# Altium schematic sheet Power.SchDoc
size A
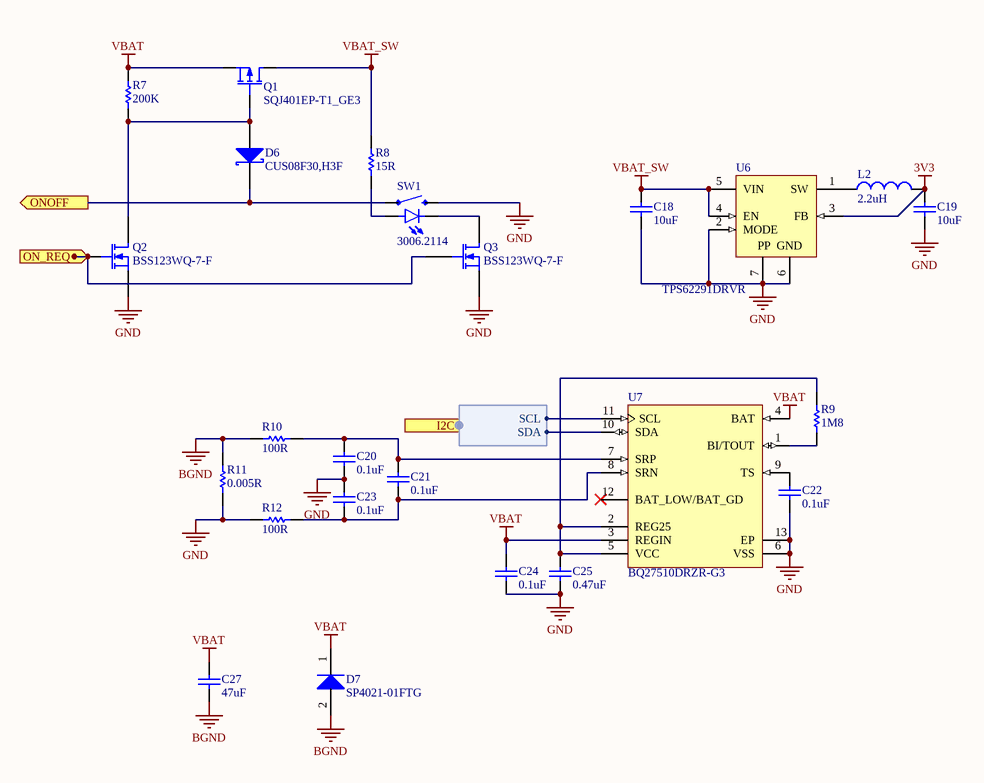
[diagram p0: Power.SchDoc]

## Parts
C18  value 10uF  [C0402[1005X55]]  (hidden comment: 10uF 6.3V 0402)
C19  value 10uF  [C0402[1005X55]]  (hidden comment: 10uF 6.3V 0402)
C20  value 0.1uF  [C0402[1005X55]]  (hidden comment: 0.1uF 6.3V 0402)
C21  value 0.1uF  [C0402[1005X55]]  (hidden comment: 0.1uF 6.3V 0402)
C22  value 0.1uF  [C0402[1005X55]]  (hidden comment: 0.1uF 6.3V 0402)
C23  value 0.1uF  [C0402[1005X55]]  (hidden comment: 0.1uF 6.3V 0402)
C24  value 0.1uF  [C0402[1005X55]]  (hidden comment: 0.1uF 6.3V 0402)
C25  value 0.47uF  [C0402[1005X55]]  (hidden comment: 0.47uF 25V 0402)
C27  value 47uF  [C1206[3216X160]]  (hidden comment: 47uF 6.3V 1206)
D6  CUS08F30,H3F  [SOD-323]
D7  SP4021-01FTG  [SOD-323]
L2  2.2uH  [IND0805]
Q1  SQJ401EP-T1_GE3  [PowerPak-8]
Q2  BSS123WQ-7-F  [SOT323-3]
Q3  BSS123WQ-7-F  [SOT323-3]
R7  value 200K  [R0402[1005]]  (hidden comment: 200K 1% 0402)
R8  value 15R  [R0402[1005]]  (hidden comment: 15R 1% 0402)
R9  value 1M8  [R0402[1005]]  (hidden comment: 1M8 1% 0402)
R10  value 100R  [R0402[1005]]  (hidden comment: 100R 1% 0402)
R11  value 0.005R  [R2512[6432]]  (hidden comment: 0.005R 1% 2512)
R12  value 100R  [R0402[1005]]  (hidden comment: 100R 1% 0402)
SW1  3006.2114  [PCBComponent_1]
U6  TPS62291DRVR  [WSON-6]
U7  BQ27510DRZR-G3  [VSON-12]

## Ports
I2C (harness I2C), ON_REQ (in), ONOFF (out)

## Harnesses
I2C: SCL, SDA

## Nets
3V3: C19.2 L2.2 U6.3(FB)
BGND: C27.1 D7.2(A) R10.1 R11.2
GND: C18.1 C19.1 C20.1 C22.1 C23.2 C24.1 C25.1 Q2.2(S) Q3.2(S) R11.1 R12.1 SW1.2 U6.2(MODE) U6.6(GND) U6.7(EP) U7.6(VSS) U7.13(EP)
VBAT: C24.2 C27.2 D7.1(K) Q1.1(S) R7.2 U7.3(REGIN) U7.4(BAT)
VBAT_SW: C18.2 Q1.3(D) R8.2 U6.4(EN) U6.5(VIN)
ON_REQ: Q2.1(G) Q3.1(G) ; port ON_REQ
ONOFF: D6.1(K) SW1.1 ; port ONOFF
NetC20_2: C20.2 C21.2 R10.2 U7.7(SRP)
NetC21_1: C21.1 C23.1 R12.2 U7.8(SRN)
NetC22_2: C22.2 U7.9(TS)
NetC25_2: C25.2 R9.2 U7.2(REG25) U7.5(VCC)
NetD6_2: D6.2(A) Q1.2(G) Q2.3(D) R7.1
NetL2_1: L2.1 U6.1(SW)
NetQ3_3: Q3.3(D) SW1.K
NetR8_1: R8.1 SW1.A
NetR9_1: R9.1 U7.1(BI/TOUT)
NetU7_10: U7.10(SDA) ; port I2C.SDA
NetU7_11: U7.11(SCL) ; port I2C.SCL

Not connected (* = marked no-connect by the designer): U7 12(BAT_LOW/BAT_GD)*

## Notes on the sheet
- (in symbol TPS62291DRVR) PP

## Library data of the parts
C18 C19 = CAP_10uF_6.3V_0402_20%: 10uF 6.3V 20% 0402 (1005 Metric); PartNumber: GRM155R60J106ME44D; Manufacturer: Murata; Tolerance: 20%; Mounting Technology: Surface Mount; PackageReference: 0402; PackageDescription: 0402 (1005 Metric); Voltage: 6.3V
C20-C24 = CAP_0.1uF_6.3V_0402_10%: 0.1uF 6.3V 10% 0402 (1005 Metric); PartNumber: GRM155R70J104KA01D; Manufacturer: Murata; Mounting Technology: Surface Mount; PackageReference: 0402; PackageDescription: 0402 (1005 Metric); Voltage: 6.3V; Tolerance: 10%
C25 = CAP_0.47uF_25V_0402_10%: 0.47uF 25V 10% 0402 (1005 Metric); PartNumber: GRM155R61E474KE01D; Manufacturer: Murata; Mounting Technology: Surface Mount; PackageReference: 0402; PackageDescription: 0402 (1005 Metric); Voltage: 25V; Tolerance: 10%
C27 = CAP_47uF_6.3V_1206_10%: 47uF 6.3V 10% 1206 (3216 Metric); PartNumber: GRM31CR60J476KE19L; Manufacturer: Murata; Mounting Technology: Surface Mount; PackageReference: 1206; PackageDescription: 1206 (3216 Metric); Voltage: 6.3V; Tolerance: 10%
D6 = CUS08F30,H3F: Manufacturer: Toshiba; PackageReference: SOD-323; PartNumber: CUS08F30,H3F; Mounting Technology: Surface Mount
D7 = SP4021-01FTG: Manufacturer: Littelfuse; PartNumber: SP4021-01FTG; PackageReference: SOD-323-2; Mounting Technology: Surface Mount
L2 = IND_2.2uH_1.7A_0805_20%: 2.2uH 20% 1.7A 0805; PartNumber: LQM21PN2R2MGHL; Manufacturer: Murata; PackageReference: 0805; PackageDescription: 0805 (2012 metric); Value: 2.2uH; Mounting Technology: Surface Mount; Current: 1.7A
Q1 = SQJ401EP-T1_GE3: P-Channel MOSFET; Manufacturer: Vishay; PartNumber: SQJ401EP-T1_GE3; Mounting Technology: Surface Mount; PackageReference: PowerPAK SO-8
Q2 Q3 = BSS123WQ-7-F: N-Channel MOSFET; Manufacturer: Diodes Incorporated; PartNumber: BSS123WQ-7-F; PackageReference: SOT-323-3; Mounting Technology: Surface Mount
R7 = RES_200K_0402_1%: 200K 0.063W 1% 0402 (1005 Metric); Manufacturer: KOA Speer; PartNumber: RK73H1ETTP2003F; Tolerance: 1%; Power: 0.063W; Mounting Technology: Surface Mount; PackageReference: 0402; PackageDescription: 0402 (1005 Metric); ComponentLink1Description: Datasheet; ComponentLink1URL: http://www.koaspeer.com/catimages/Products/RK73H/RK73H.pdf
R8 = RES_15R_0402_1%: 15R 0.063W 1% 0402 (1005 Metric); Manufacturer: KOA Speer; PartNumber: RK73H1ETTP15R0F; Tolerance: 1%; Power: 0.063W; Mounting Technology: Surface Mount; PackageReference: 0402; PackageDescription: 0402 (1005 Metric); ComponentLink1Description: Datasheet; ComponentLink1URL: http://www.koaspeer.com/catimages/Products/RK73H/RK73H.pdf
R9 = RES_1M8_0402_1%: 1M8 0.063W 1% 0402 (1005 Metric); Manufacturer: KOA Speer; PartNumber: RK73H1ETTP1804F; Tolerance: 1%; Power: 0.063W; Mounting Technology: Surface Mount; PackageReference: 0402; PackageDescription: 0402 (1005 Metric); ComponentLink1Description: Datasheet; ComponentLink1URL: http://www.koaspeer.com/catimages/Products/RK73H/RK73H.pdf
R10 R12 = RES_100R_0402_1%: 100R 0.063W 1% 0402 (1005 Metric); Manufacturer: KOA Speer; PartNumber: RK73H1ETTP1000F; Tolerance: 1%; Power: 0.063W; Mounting Technology: Surface Mount; PackageReference: 0402; PackageDescription: 0402 (1005 Metric); ComponentLink1Description: Datasheet; ComponentLink1URL: http://www.koaspeer.com/catimages/Products/RK73H/RK73H.pdf
R11 = RES_0.005R_2512_1%: 0.005R 2.5W 1% 2512 (6432 Metric); Manufacturer: Riedon; PartNumber: CSR2512B0R005F; Tolerance: 1%; Power: 2.5W; Mounting Technology: Surface Mount; PackageReference: 2512; PackageDescription: 2512 (6432 Metric); ComponentLink1Description: Datasheet; ComponentLink1URL: https://industrial.panasonic.com/cdbs/www-data/pdf/RDA0000/AOA0000C239.pdf
SW1 = 3006.2114: Manufacturer: Marquadt; PartNumber: 3006.2114; Mounting Technology: Surface Mount
U6 = TPS62291DRVR: Voltage Regulators - Switching Regulators 2.25MHz 1A Step-Down Cnvrtr 3.3V Output; Manufacturer: Texas Instruments; PartNumber: TPS62291DRVR; PackageReference: WSON-6; PackageDescription: SON, 6-Leads, Body 2x2mm, Pitch 0.65mm, Thermal Pad 1.6x1mm, TI Recommended; Mounting Technology: Surface Mount
U7 = BQ27510DRZR-G3: Battery Management System-Side Impedance Track Fuel Gauge; Manufacturer: Texas Instruments; PartNumber: BQ27510DRZR-G3; PackageReference: VSON-12; Mounting Technology: Surface Mount